# EAGLE design V1.01 (EAGLE 7.7.0)

## Sheet 1 of 4
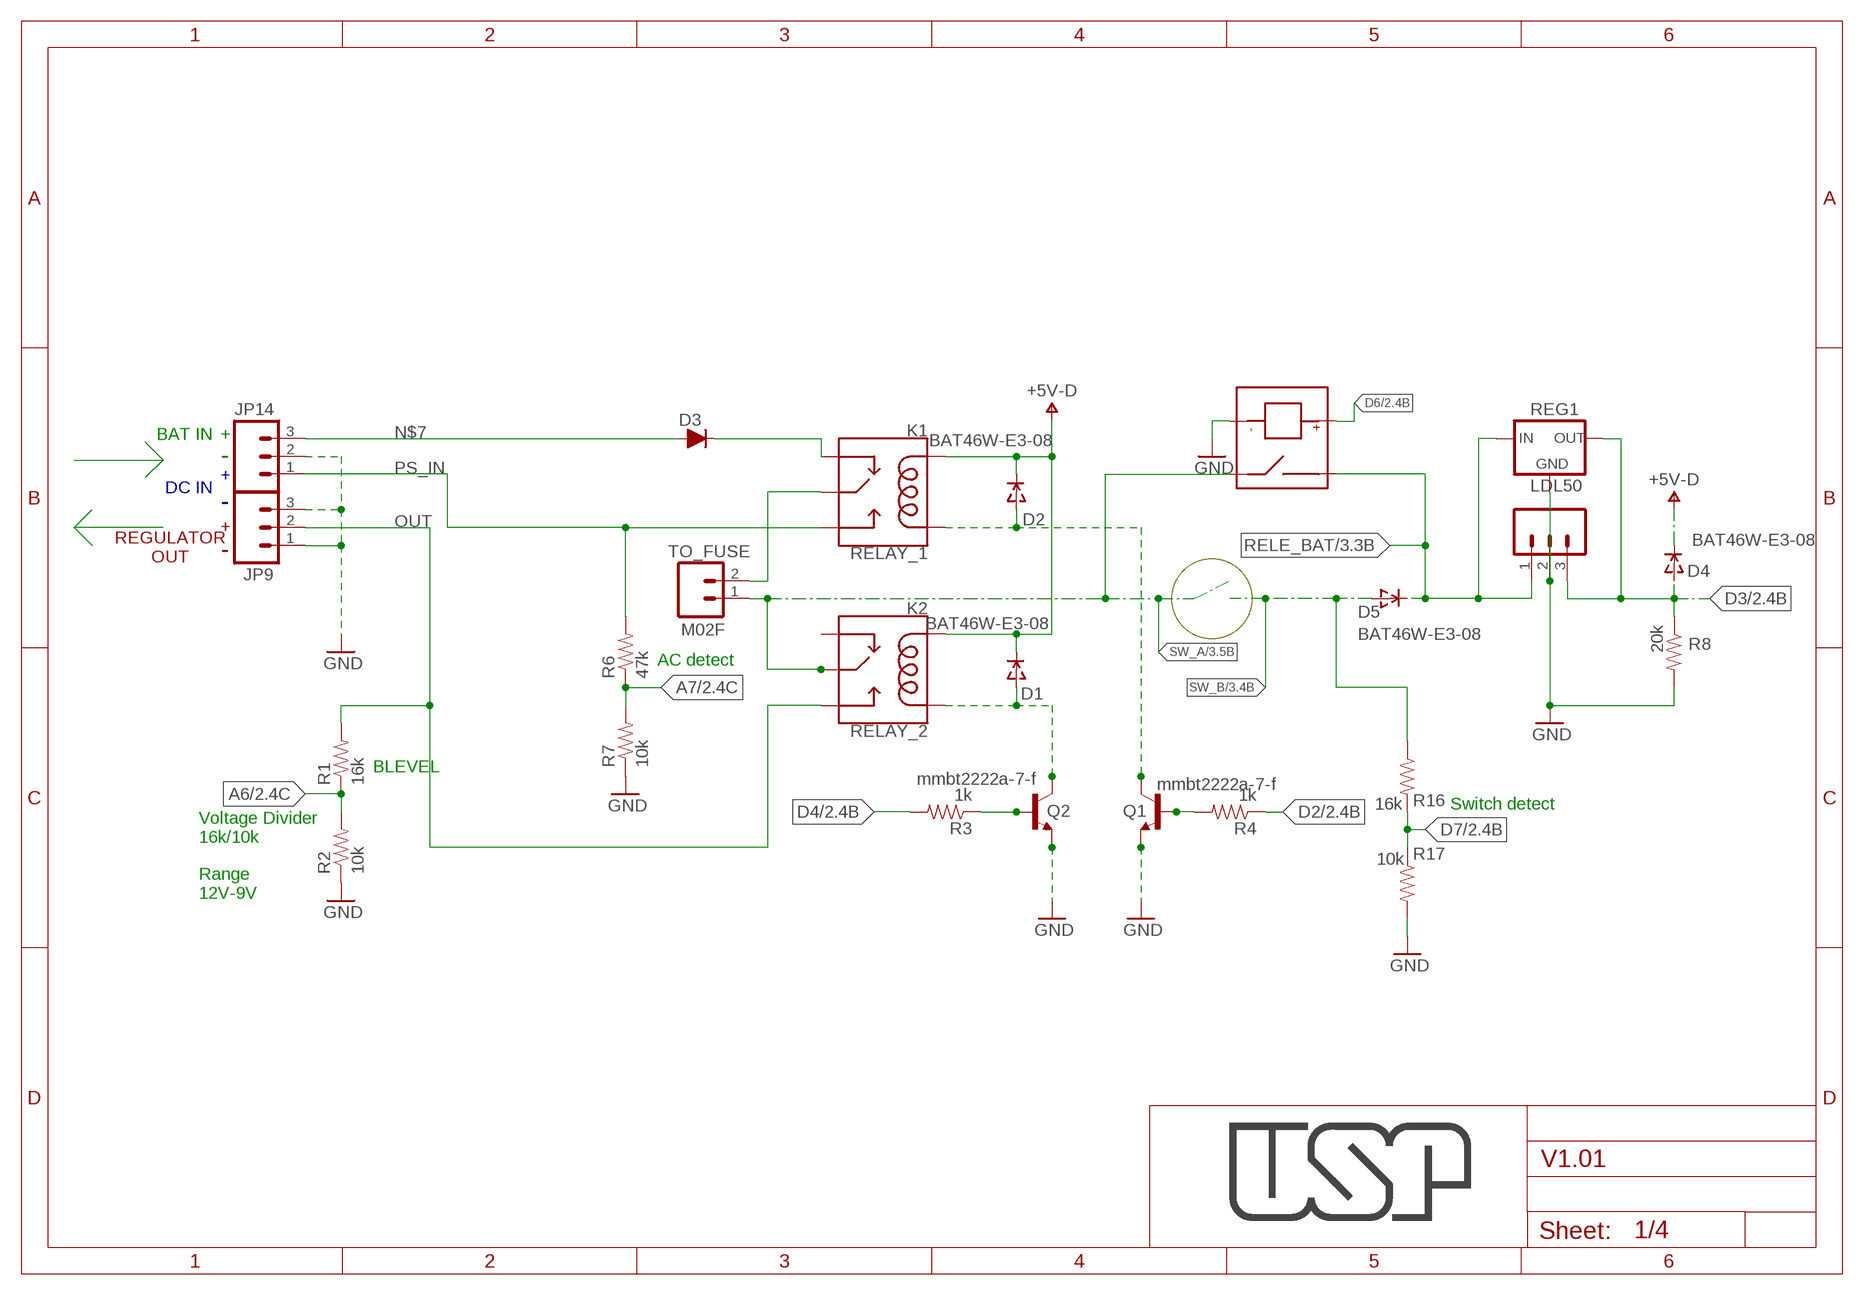
[diagram p0: schematic, sheet 1]

### Parts
7805  M03LOCK  [1X03_LOCK]
D1  BAT46W-E3-08  DIODE_1SOD-123  [SOD-123]
D2  BAT46W-E3-08  DIODE_1SOD-123  [SOD-123]
D3  DIODEFR  [DIODE1.5A]
D4  BAT46W-E3-08  DIODE_1SOD-123  [SOD-123]
D5  BAT46W-E3-08  DIODE_1SOD-123  [SOD-123]
JP9  M03  [AK500]
JP14  M03  [AK500]
K1  RELAY_1  RELAY-PACKA  [RELAY_G5LE]
K2  RELAY_2  RELAY-PACKA  [RELAY_G5LE]
Q1  mmbt2222a-7-f  TRANSISTOR_NPNMPSA42  [SOT23-3]
Q2  mmbt2222a-7-f  TRANSISTOR_NPNMPSA42  [SOT23-3]
Q3  TRANSISTOR-NPN-BC337  [BC337]
Q4  TRANSISTOR-NPN-BC337  [BC337]
R1  16k  RESISTORVISHAY  [0402]
R2  10k  RESISTORVISHAY  [0402]
R3  1k  RESISTORVISHAY  [0402]
R4  1k  RESISTORVISHAY  [0402]
R6  47k  RESISTORVISHAY  [0402]
R7  10k  RESISTORVISHAY  [0402]
R8  20k  RESISTORVISHAY  [0402]
R16  16k  RESISTORVISHAY  [0402]
R17  10k  RESISTORVISHAY  [0402]
REG1  LDL50  REGULATOR_1117AMS117  [SOT223]
RL1  RELAY_HE3621A0500  [HE3621A]
TO_FUSE  M02F  [AK500M2]

### Nets
+5V-D: D1.C D2.C D4.C K1.2(COIL1) K2.2(COIL1) ; also sheet 2,3,4
A6: R1.P$1 R2.P$2 ; also sheet 2
A7: R6.P$1 R7.P$2 ; also sheet 2
D2: R4.P$1 ; also sheet 2
D3: 7805.3 D4.A R8.P$1 REG1.2(OUT) REG1.4(OUT) ; also sheet 2
D4: R3.P$2 ; also sheet 2
D6: RL1.P2 ; also sheet 2,3
D7: R16.P$2 R17.P$1 ; also sheet 2,3
GND: 7805.2 JP9.1 JP9.3 JP14.2 Q1.2(E) Q2.2(E) Q3.1(E) Q4.1(E) R2.P$1 R7.P$1 R8.P$2 R17.P$2 REG1.1(GND) RL1.P3 ; also sheet 2,3,4
N$1: K1.1(MAIN) TO_FUSE.2
N$5: D2.A K1.5(COIL2) Q1.3(C) Q4.3(C)
N$6: D1.A K2.5(COIL2) Q2.3(C) Q3.3(C)
N$7: D3.A JP14.3
N$23: Q1.1(B) Q4.2(B) R4.P$2
N$26: D3.C K1.4(NC)
OUT: JP9.2 K2.3(NO) R1.P$2
PS_IN: JP14.1 K1.3(NO) R6.P$2
RELE_BAT: 7805.1 D5.C REG1.3(IN) RL1.P1 ; also sheet 3
STARTUP: Q2.1(B) Q3.2(B) R3.P$1
SW_A: K2.1(MAIN) RL1.P4 TO_FUSE.1 ; also sheet 3
SW_B: D5.A R16.P$1 ; also sheet 3
Unconnected: K2.4(NC)

### Notes on the sheet
- BAT IN | +
- -
- +
- DC IN
- -
- +
- REGULATOR
  OUT
- -
- AC detect
- BLEVEL
- Switch detect
- Voltage Divider
  16k/10k 
  
  Range
  12V-9V

## Sheet 2 of 4
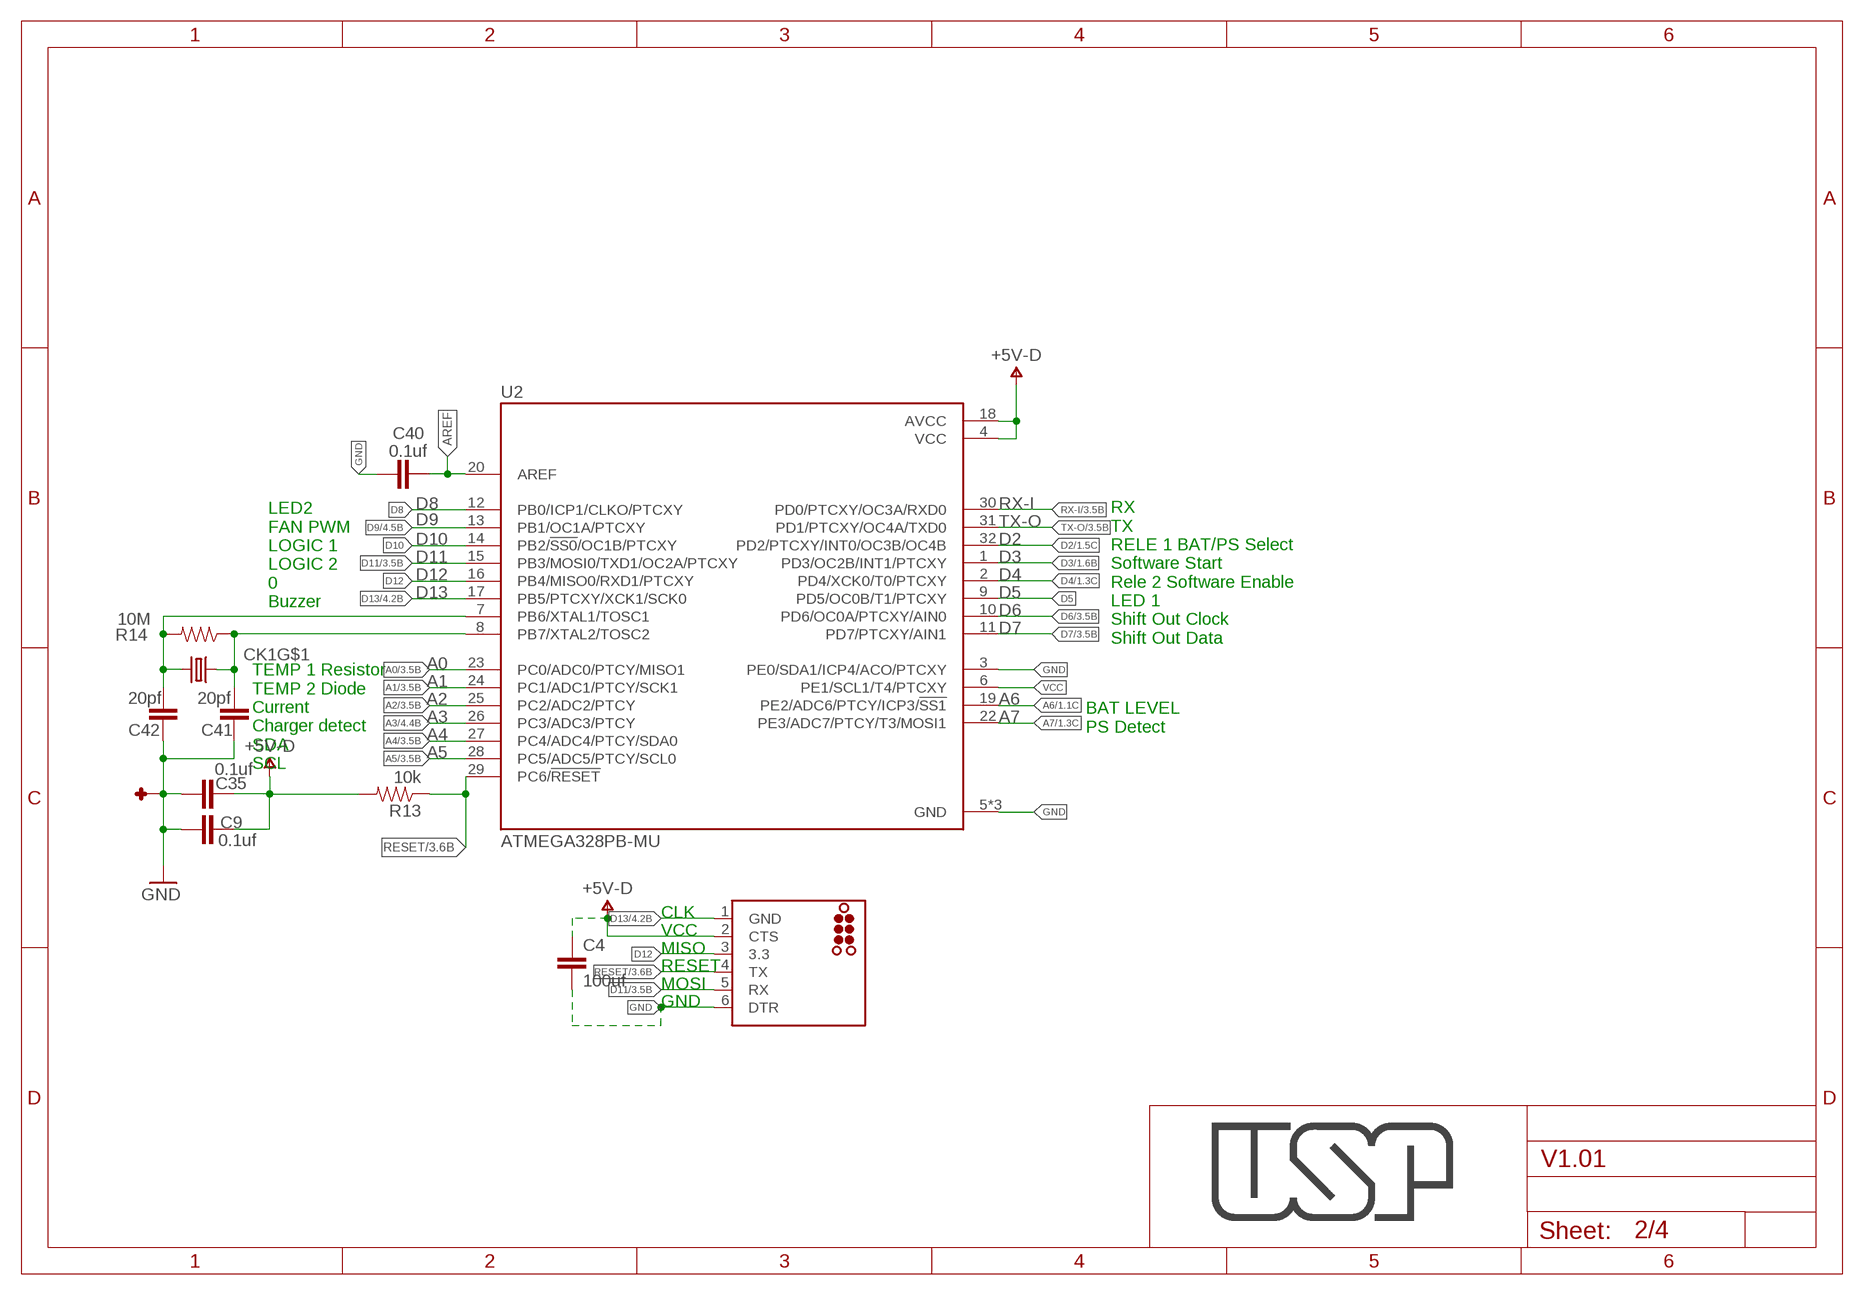
[diagram p1: schematic, sheet 2]

### Parts
C4  100uf  CAPACITOR-KIT-11206  [1206]
C9  0.1uf  CAPACITOR-KIT-1VISHAY  [0402]
C35  0.1uf  CAPACITOR-KIT-1VISHAY  [0402]
C40  0.1uf  CAPACITOR-KIT-1VISHAY  [0402]
C41  20pf  CAPACITOR-KIT-1VISHAY  [0402]
C42  20pf  CAPACITOR-KIT-1VISHAY  [0402]
CK1  FA-238 16.0000MB-C3  CRYSTAL-4PAD  [4-SMD@1]
J10  DNP  FTDI-POGO-MCP-NL  [TC2030-MCP-NL]
R13  10k  RESISTORVISHAY  [0402]
R14  10M  RESISTORVISHAY  [0402]
U2  ATMEGA328PB-MU  [QFN50P500X500X90-33N]

### Nets
+5V-D: C4.1 C9.P$2 C35.P$2 J10.2(CTS) R13.P$2 U2.4(VCC) U2.18(AVCC) ; also sheet 1,3,4
A0: U2.23(PC0/ADC0/PTCY/MISO1) ; also sheet 3
A1: U2.24(PC1/ADC1/PTCY/SCK1) ; also sheet 3
A2: U2.25(PC2/ADC2/PTCY) ; also sheet 3
A3: U2.26(PC3/ADC3/PTCY) ; also sheet 4
A4: U2.27(PC4/ADC4/PTCY/SDA0) ; also sheet 3,4
A5: U2.28(PC5/ADC5/PTCY/SCL0) ; also sheet 3,4
A6: U2.19(PE2/ADC6/PTCY/ICP3/!SS1!) ; also sheet 1
A7: U2.22(PE3/ADC7/PTCY/T3/MOSI1) ; also sheet 1
AREF: C40.P$1 U2.20(AREF)
D2: U2.32(PD2/PTCXY/INT0/OC3B/OC4B) ; also sheet 1
D3: U2.1(PD3/OC2B/INT1/PTCXY) ; also sheet 1
D4: U2.2(PD4/XCK0/T0/PTCXY) ; also sheet 1
D5: U2.9(PD5/OC0B/T1/PTCXY)
D6: U2.10(PD6/OC0A/PTCXY/AIN0) ; also sheet 1,3
D7: U2.11(PD7/PTCXY/AIN1) ; also sheet 1,3
D8: U2.12(PB0/ICP1/CLKO/PTCXY)
D9: U2.13(PB1/OC1A/PTCXY) ; also sheet 4
D10: U2.14(PB2/!SS0!/OC1B/PTCXY)
D11: J10.5(RX) U2.15(PB3/MOSI0/TXD1/OC2A/PTCXY) ; also sheet 3
D12: J10.3(3.3) U2.16(PB4/MISO0/RXD1/PTCXY)
D13: J10.1(GND) U2.17(PB5/PTCXY/XCK1/SCK0) ; also sheet 4
GND: C4.2 C9.P$1 C35.P$1 C40.P$2 C41.P$2 C42.P$2 CK1.GND1 CK1.GND2 J10.6(DTR) U2.3(PE0/SDA1/ICP4/ACO/PTCXY) U2.5(GND) U2.21(GND) U2.33(GND) ; also sheet 1,3,4
N$67: C41.P$1 CK1.P1 R14.P$1 U2.8(PB7/XTAL2/TOSC2)
N$68: C42.P$1 CK1.P3 R14.P$2 U2.7(PB6/XTAL1/TOSC1)
RESET: J10.4(TX) R13.P$1 U2.29(PC6/!RESET!) ; also sheet 3
RX-I: U2.30(PD0/PTCXY/OC3A/RXD0) ; also sheet 3
TX-O: U2.31(PD1/PTCXY/OC4A/TXD0) ; also sheet 3
VCC: U2.6(PE1/SCL1/T4/PTCXY)

### Notes on the sheet
- RX
  TX
  RELE 1 BAT/PS Select
  Software Start
  Rele 2 Software Enable
  LED 1
  Shift Out Clock
  Shift Out Data
- D8
- D9
- D11
- LED2
  FAN PWM
  LOGIC 1
  LOGIC 2
  0
  Buzzer
- BAT LEVEL
  PS Detect
- A2
- TEMP 1 Resistor
  TEMP 2 Diode
  Current
  Charger detect
  SDA
  SCL
- CLK
  VCC
  MISO
  RESET
  MOSI
  GND

## Sheet 3 of 4
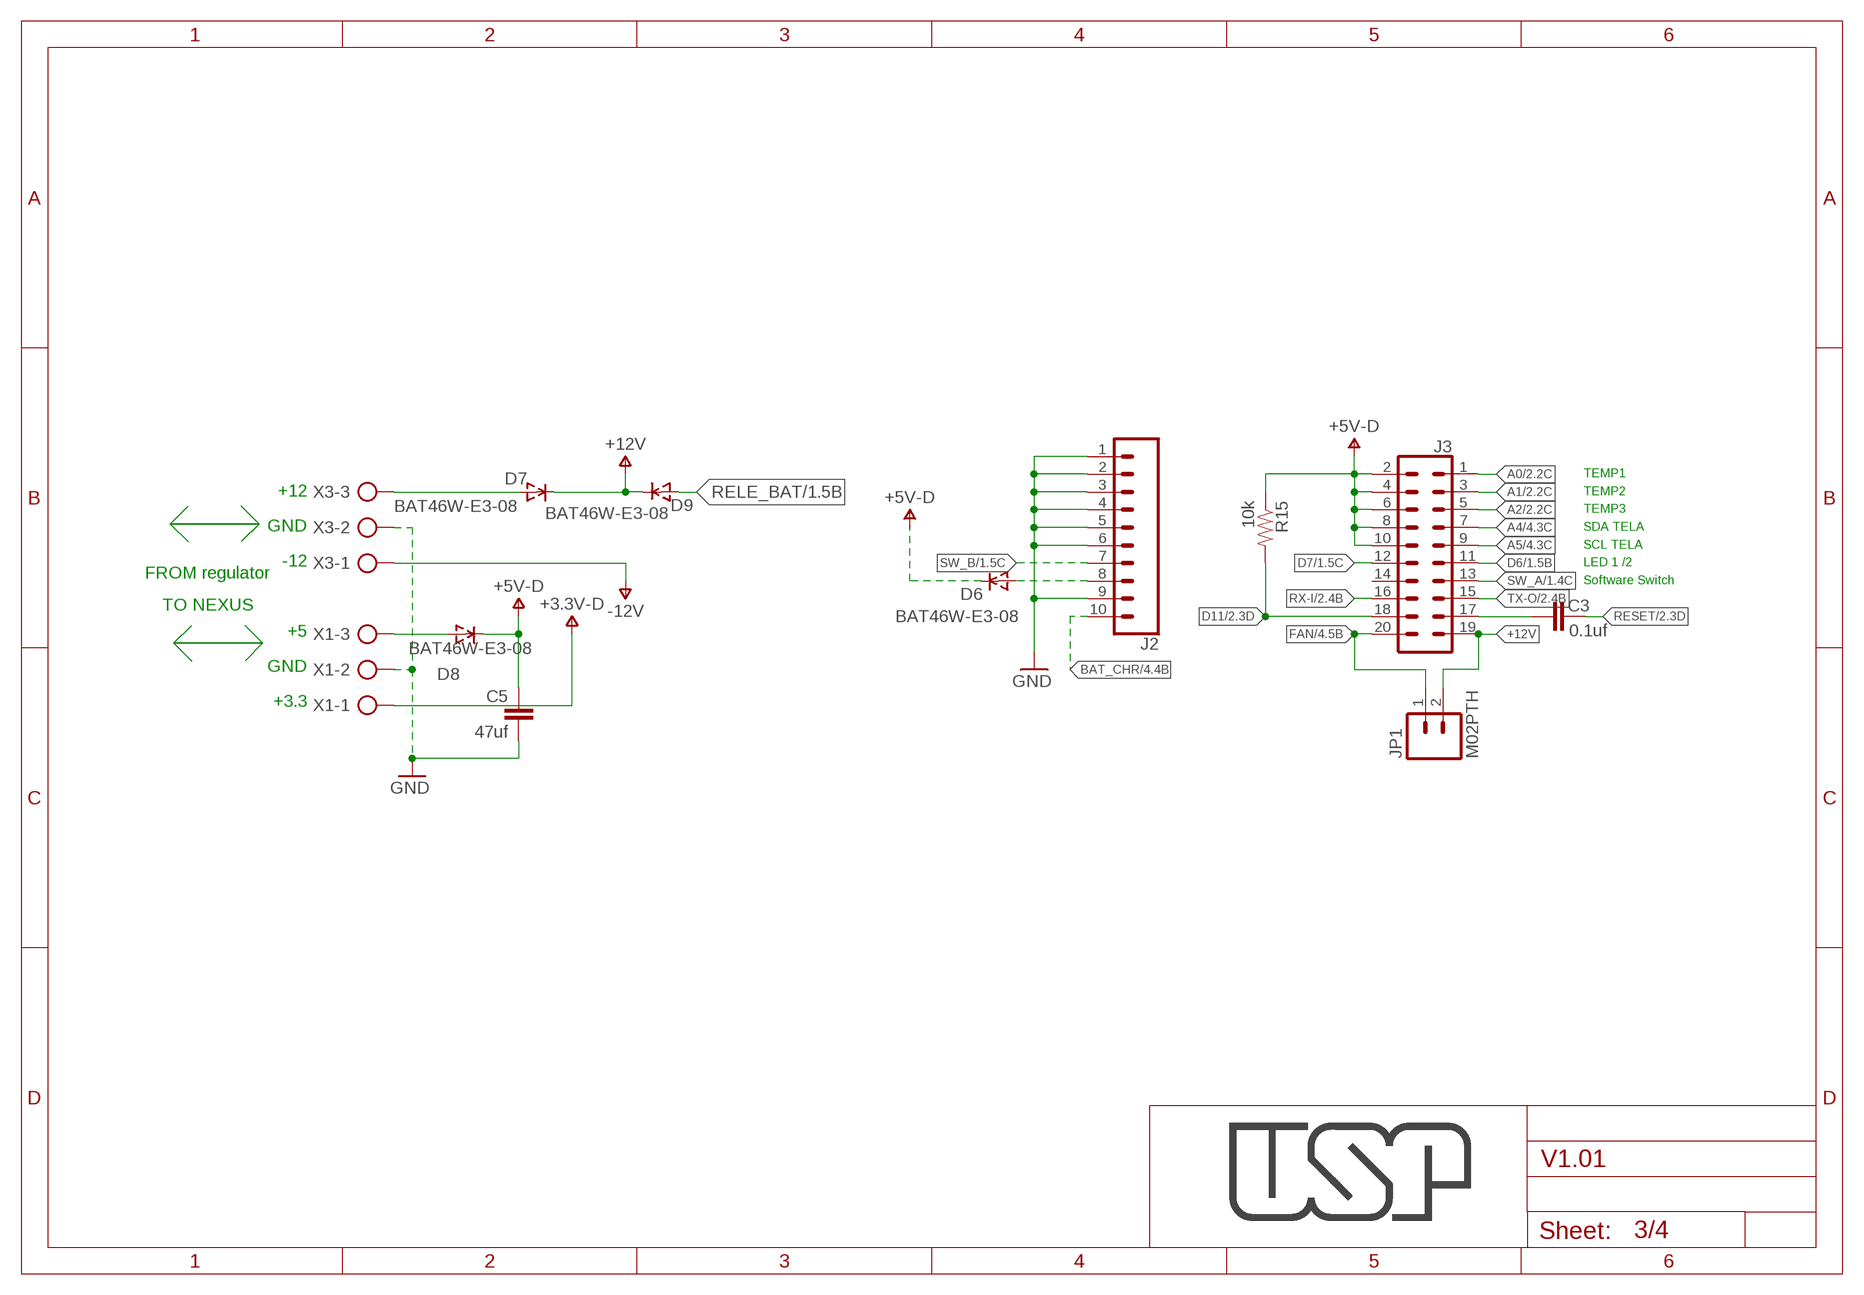
[diagram p2: schematic, sheet 3]

### Parts
C3  0.1uf  CAPACITOR-KIT-1VISHAY  [0402]
C5  47uf  CAPACITOR-KIT-11206  [1206]
D6  BAT46W-E3-08  DIODE_1SOD-123  [SOD-123]
D7  BAT46W-E3-08  DIODE_1SOD-123  [SOD-123]
D8  BAT46W-E3-08  DIODE_1SOD-123  [SOD-123]
D9  BAT46W-E3-08  DIODE_1SOD-123  [SOD-123]
J2  CONN_10"  [1X10]
J3  CONN_10X2  [2X10]
JP1  M02PTH  [1X02]
R15  10k  RESISTORVISHAY  [0402]
X1  AK500/3-H  [AK500/3-H]
X3  AK500/3-H  [AK500/3-H]

### Nets
+3.3V-D: X1.1
+5V-D: C5.1 D6.C D8.C J3.2 J3.4 J3.6 J3.8 J3.10 R15.P$1 ; also sheet 1,2,4
+12V: D7.C D9.C J3.19 JP1.2
-12V: X3.1
A0: J3.1 ; also sheet 2
A1: J3.3 ; also sheet 2
A2: J3.5 ; also sheet 2
A4: J3.7 ; also sheet 2,4
A5: J3.9 ; also sheet 2,4
BAT_CHR: J2.10 ; also sheet 4
D6: J3.11 ; also sheet 1,2
D7: J3.12 ; also sheet 1,2
D11: J3.18 R15.P$2 ; also sheet 2
FAN: J3.20 JP1.1 ; also sheet 4
GND: C5.2 J2.1 J2.2 J2.3 J2.4 J2.5 J2.6 J2.9 X1.2 X3.2 ; also sheet 1,2,4
N$2: D8.A X1.3
N$3: D6.A J2.8
N$8: D7.A X3.3
RELE_BAT: D9.A ; also sheet 1
RESET: C3.P$2 ; also sheet 2
RESETT: C3.P$1 J3.17
RX-I: J3.16 ; also sheet 2
SW_A: J3.13 ; also sheet 1
SW_B: J2.7 ; also sheet 1
TX-O: J3.15 ; also sheet 2
Unconnected: J3.14

### Notes on the sheet
- +12
  
  GND
  
  -12
- FROM regulator
- TEMP1
  TEMP2
  TEMP3
  SDA TELA
  SCL TELA
  LED 1 /2
  Software Switch
- TO NEXUS
- +5
  
  GND
  
  +3.3

## Sheet 4 of 4
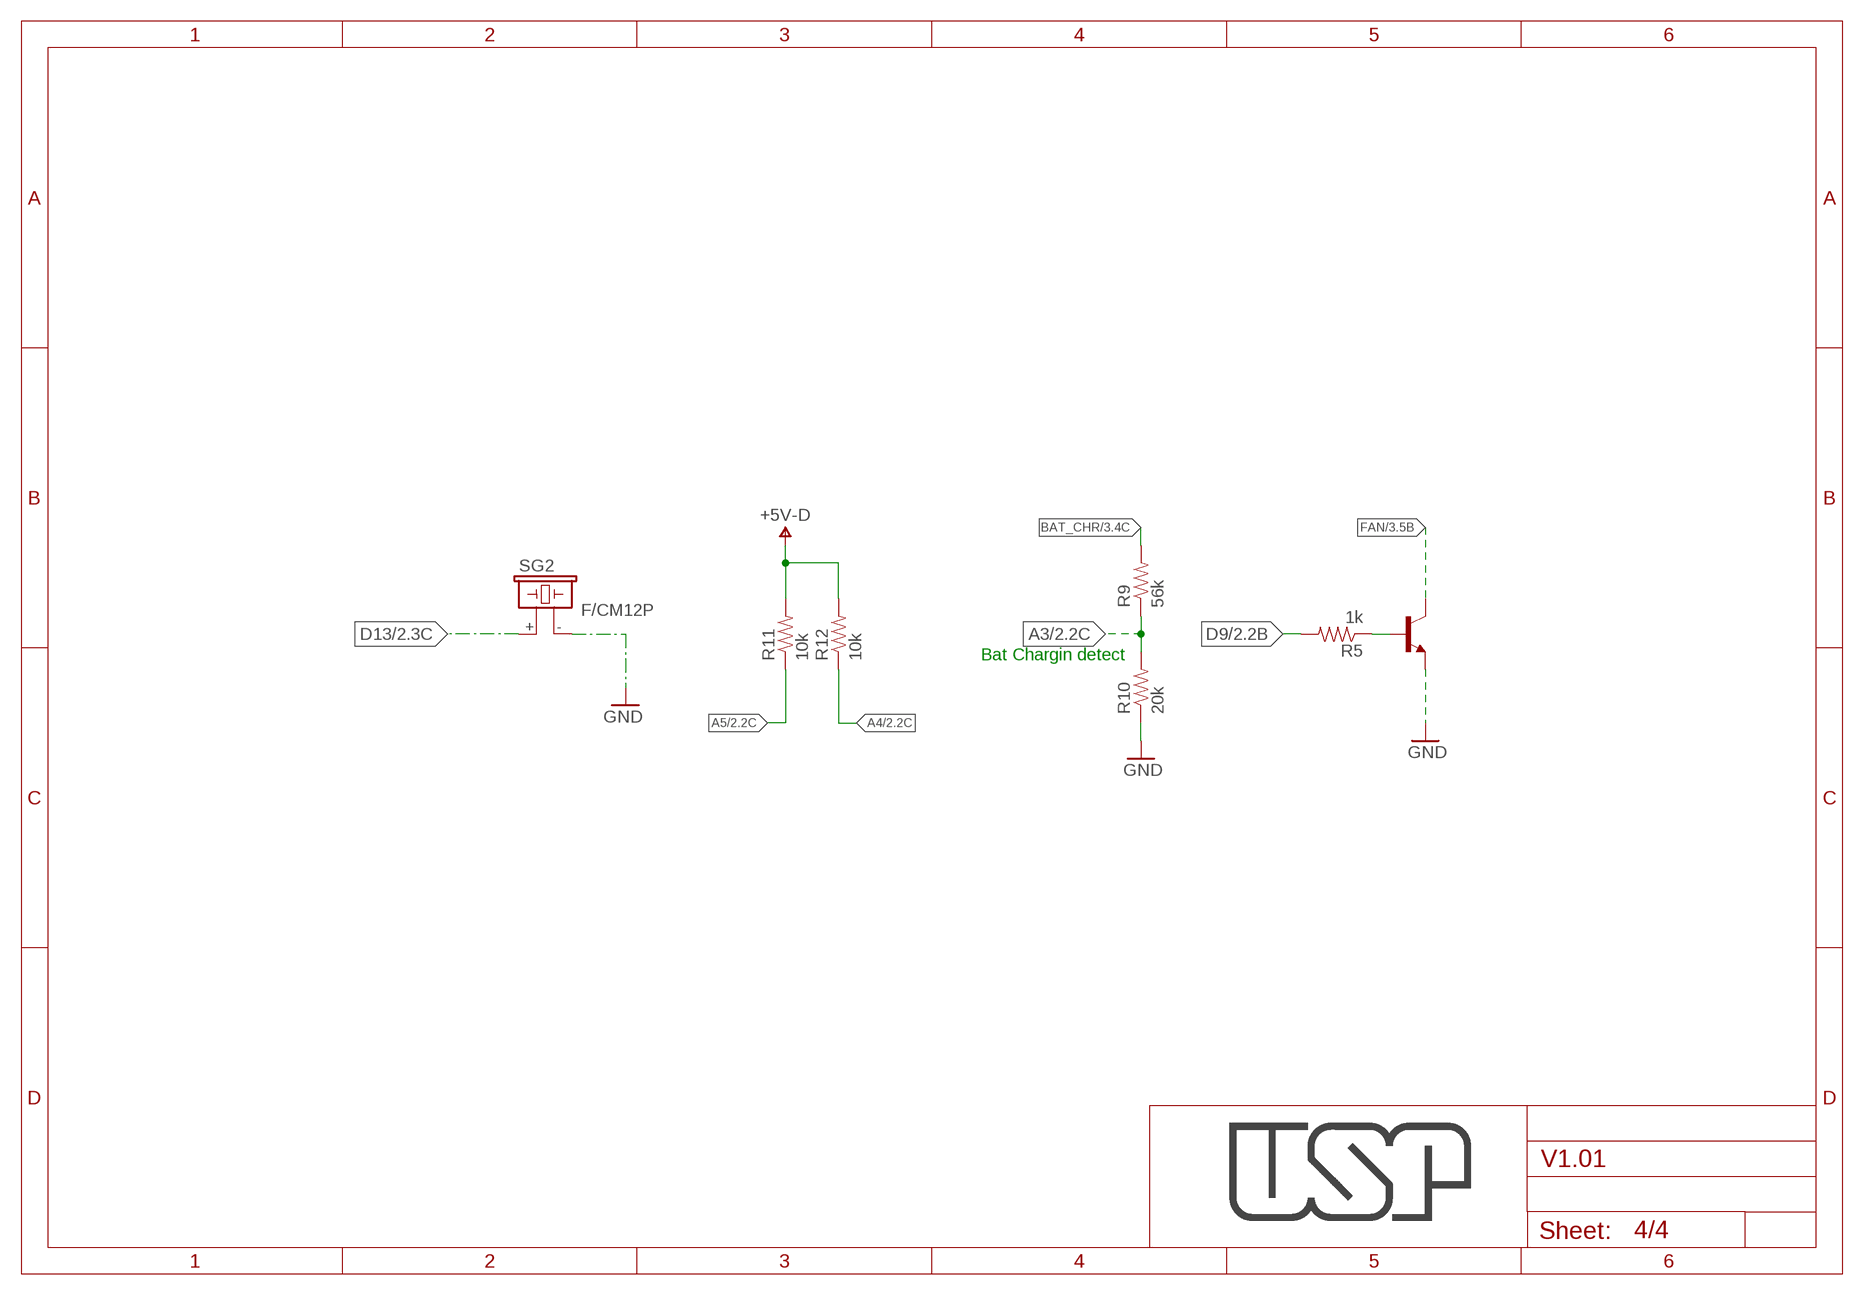
[diagram p3: schematic, sheet 4]

### Parts
Q5  TRANSISTOR-NPN-BC337  [BC337]
R5  1k  RESISTORVISHAY  [0402]
R9  56k  RESISTORVISHAY  [0402]
R10  20k  RESISTORVISHAY  [0402]
R11  10k  RESISTORVISHAY  [0402]
R12  10k  RESISTORVISHAY  [0402]
SG2  F/CM12P  [F/CM12P]

### Nets
+5V-D: R11.P$2 R12.P$2 ; also sheet 1,2,3
A3: R9.P$1 R10.P$2 ; also sheet 2
A4: R12.P$1 ; also sheet 2,3
A5: R11.P$1 ; also sheet 2,3
BAT_CHR: R9.P$2 ; also sheet 3
D9: R5.P$2 ; also sheet 2
D13: SG2.+ ; also sheet 2
FAN: Q5.3(C) ; also sheet 3
GND: Q5.1(E) R10.P$1 SG2.- ; also sheet 1,2,3
N$21: Q5.2(B) R5.P$1

### Notes on the sheet
- Bat Chargin detect

## Library data of the parts
7805 JP9 JP14 = 1MaxBYB-Parts:M03: Header 3 Standard 3-pin 0.1" header. Use with straight break away headers (SKU : PRT-00116), right angle break away headers (PRT-00553), swiss pins (PRT-00743), machine pins (PRT-00117), and female headers (PRT-00115). Molex polarized connector foot print use with SKU : PRT-08232 with associated crimp pins and housings.
C3-C5 C9 C35 C40-C42 = 1MaxBYB-Parts:CAPACITOR-KIT-1: Capacitor Standard 0603 ceramic capacitor, and 0.1" leaded capacitor.
CK1 = 1MaxBYB-Parts:CRYSTAL-4PAD
D1 D2 D4-D9 = dp_devices:DIODE_1: Zener Diode SOD-323
D3 = 1MaxBYB-Parts:DIODE: DIODE filled
J2 = SparkFun-Connectors:CONN_10: Multi connection point. Often used as Generic Header-pin footprint for 0.1 inch spaced/style header connections On any of the 0.1 inch spaced packages, you can populate with these: Break Away Headers - Straight <https://www.sparkfun.com/products/116> (PRT-00116) Break Away Male Headers - Right Angle <https://www.sparkfun.com/products/553> (PRT-00553) Female Headers <https://www.sparkfun.com/products/115> (PRT-00115) Break Away Headers - Machine Pin <https://www.sparkfun.com/products/117> (PRT-00117) Break Away Female Headers - Swiss Machine Pin <https://www.sparkfun.com/products/743> (PRT-00743) Arduino Stackable Header - 10 Pin <https://www.sparkfun.com/products/11376> (PRT-11376) For SCREWTERMINALS and SPRING TERMINALS visit here: Screw Terimnals on SparkFun.com <https://www.sparkfun.com/search/results?term=Screw+Terminals> (5mm/3.5mm/2.54mm spacing) This device is also useful as a general connection point to wire up your design to another part of your project. Our various solder wires solder well into these plated through hole pads. Hook-Up Wire - Assortment (Stranded, 22 AWG) <https://www.sparkfun.com/products/11375> (PRT-11375) Hook-Up Wire - Assortment (Solid Core, 22 AWG) <https://www.sparkfun.com/products/11367> (PRT-11367) View the entire wire category on our website here <https://www.sparkfun.com/categories/141> Special notes: Molex polarized connector foot print use with SKU : PRT-08231 with associated crimp pins and housings. 1MM SMD Version SKU: PRT-10208 NOTES ON THE VARIANTS LOCK and LOCK_LONGPADS... This footprint was designed to help hold the alignment of a through-hole component (i.e. 6-pin header) while soldering it into place. You may notice that each hole has been shifted either up or down by 0.005 of an inch from it's more standard position (which is a perfectly straight line). This slight alteration caused the pins (the squares in the middle) to touch the edges of the holes. Because they are alternating, it causes a "brace" to hold the component in place. 0.005 has proven to be the perfect amount of "off-center" position when using our standard breakaway headers. Although looks a little odd when you look at the bare footprint, once you have a header in there, the alteration is very hard to notice. Also,if you push a header all the way into place, it is covered up entirely on the bottom side.; PROD_ID: CONN-11563
J3 = SparkFun-Connectors:CONN_10X2: Multi connection point. Often used as Generic Header-pin footprint for 0.1 inch spaced/style header connections On any of the 0.1 inch spaced packages, you can populate with these: Break Away Headers - Straight <https://www.sparkfun.com/products/116> (PRT-00116) Break Away Male Headers - Right Angle <https://www.sparkfun.com/products/553> (PRT-00553) Female Headers <https://www.sparkfun.com/products/115> (PRT-00115) Break Away Headers - Machine Pin <https://www.sparkfun.com/products/117> (PRT-00117) Break Away Female Headers - Swiss Machine Pin <https://www.sparkfun.com/products/743> (PRT-00743) Special note about the "SPECIAL" package: This was SPECIALLY designed to be used with our Graphic LCD Backpack. Be sure you want to use this! It is not only staggered on each line of header holes, but IT IS ALSO offset of the center point of the top and bottom lines by 5 mil. This causes the headers to lock into place on the "standard" footprint on the LCD screen. The extra squares on the tdocu layer are there simply to reference other pins (if you were to actually populate a longer header than ten long - this is what we do with the backpacks).
J10 = MaxBYB:FTDI-POGO: TAG-CONNECT ICSP Connector Manufacturer: Tag-Connect <http://www.tag-connect.com> Cable for easy In-Circuit Serial Programming. Designed for Microchip ICD2, suitable for many others. Two variants - one "with legs" (for hands-free fit on PCB) and another "without legs" for quick programming. PAD Description 1 MCLR/Vpp 2 Vdd 3 GND 4 PGD (ISPDAT) 5 PGC (ISPCLK) 6 nc (used for LVP) ©2009 ROFA.cz - modified and updated by Robert Darlington ‹rdarlington@gmail.com›
JP1 TO_FUSE = 1MaxBYB-Parts:M02: Standard 2-pin 0.1" header. Use with - straight break away headers ( PRT-00116) - right angle break away headers (PRT-00553) - swiss pins (PRT-00743) - machine pins (PRT-00117) - female headers (PRT-00115) Molex polarized connector foot print use with: PRT-08233 with associated crimp pins and housings. 2.54_SCREWTERM for use with PRT-10571. 3.5mm Screw Terminal footprints for PRT-08084 5mm Screw Terminal footprints for use with PRT-08432
K1 K2 = 1MaxBYB-Parts:RELAY-PACK: SPDT Electromechanical Relay Single-pole, double-throw sealed relays. When current is applied to the coil, it throws a simple changeover switch, terminating the connection from the NC contact to ground and closing the NO contact. Use them to switch high voltage/high current devices. SparkFun Products JQX-15F: Relay SPDT Sealed - 20A <https://www.sparkfun.com/products/10924> (COM-10924) JZC-11F: Relay SPDT Sealed <https://www.sparkfun.com/products/100> (COM-00100); PROD_ID: COMP-14214
Q1 Q2 = MaxBYB:TRANSISTOR_NPN: Generic NPN BJT MMBT2222A - TRANS-08049 (SOT-23, 1A 40V) MPSA42 - TRANS-09116 (SOT-23, 500mA 300V) MMBT5088LT1G - TRANS-11160 (SOT-23, 50 mA 30V) BC547 - COM-08928 <http://www.sparkfun.com/products/8928> (TO-92 45V 100mA) (1.Collector 2.Base 3.Emitter) 2N3904 - COM-00521 <http://www.sparkfun.com/products/521> (TO-92 40V 200mA) (1.Emitter 2.Base 3.Collector) P2N2222A - COM-12852 <http://www.sparkfun.com/products/12852> (TO-92 40V 600mA) (1.Collector 2.Base 3.Emitter); PROD_ID: TRANS-09116; VALUE: MPSA42
Q3-Q5 = 1MaxBYB-Parts:TRANSISTOR-NPN-BC337
R1-R17 = 1MaxBYB-Parts:RESISTOR: Resistor Basic schematic elements and footprints for 0603, 1206, and PTH 1/10th watt (small) resistors.
REG1 = 1MaxBYB-Parts:REGULATOR_1117
RL1 = 1MaxBYB-Parts:RELAY_HE3621A0500
SG2 = buzzer:F/CM12P: BUZZER Source: Buerklin; OC_FARNELL: unknown; OC_NEWARK: unknown
U2 = ATMEGA328PB-MU:ATMEGA328PB-MU: AVR 32KBytes Flash, 1KBytes EEPROM, 2KBytes RAM, w - 20MHZ, QFN/MFL, IND TEMP, GREEN 5 V/ DFN/QFN (M); AVAILABILITY: Unavailable; DESCRIPTION: AVR 32KBytes Flash, 1KBytes EEPROM, 2KBytes RAM, w - 20MHZ, QFN/MFL, IND TEMP, GREEN 5 V/ DFN/QFN _M_; MF: Microchip; MP: ATMEGA328PB-MU; PACKAGE: VFQFN-32 Microchip; PRICE: None
X1 X3 = con-ptr500:AK500/3-H: CONNECTOR Aug. 2004 / PTR Meßtechnik: Die Bezeichnung der Serie AK505 wurde geändert. Es handelt sich hierbei um AK500 in horizontaler Ausführung.; OC_FARNELL: unknown; OC_NEWARK: unknown

## Board
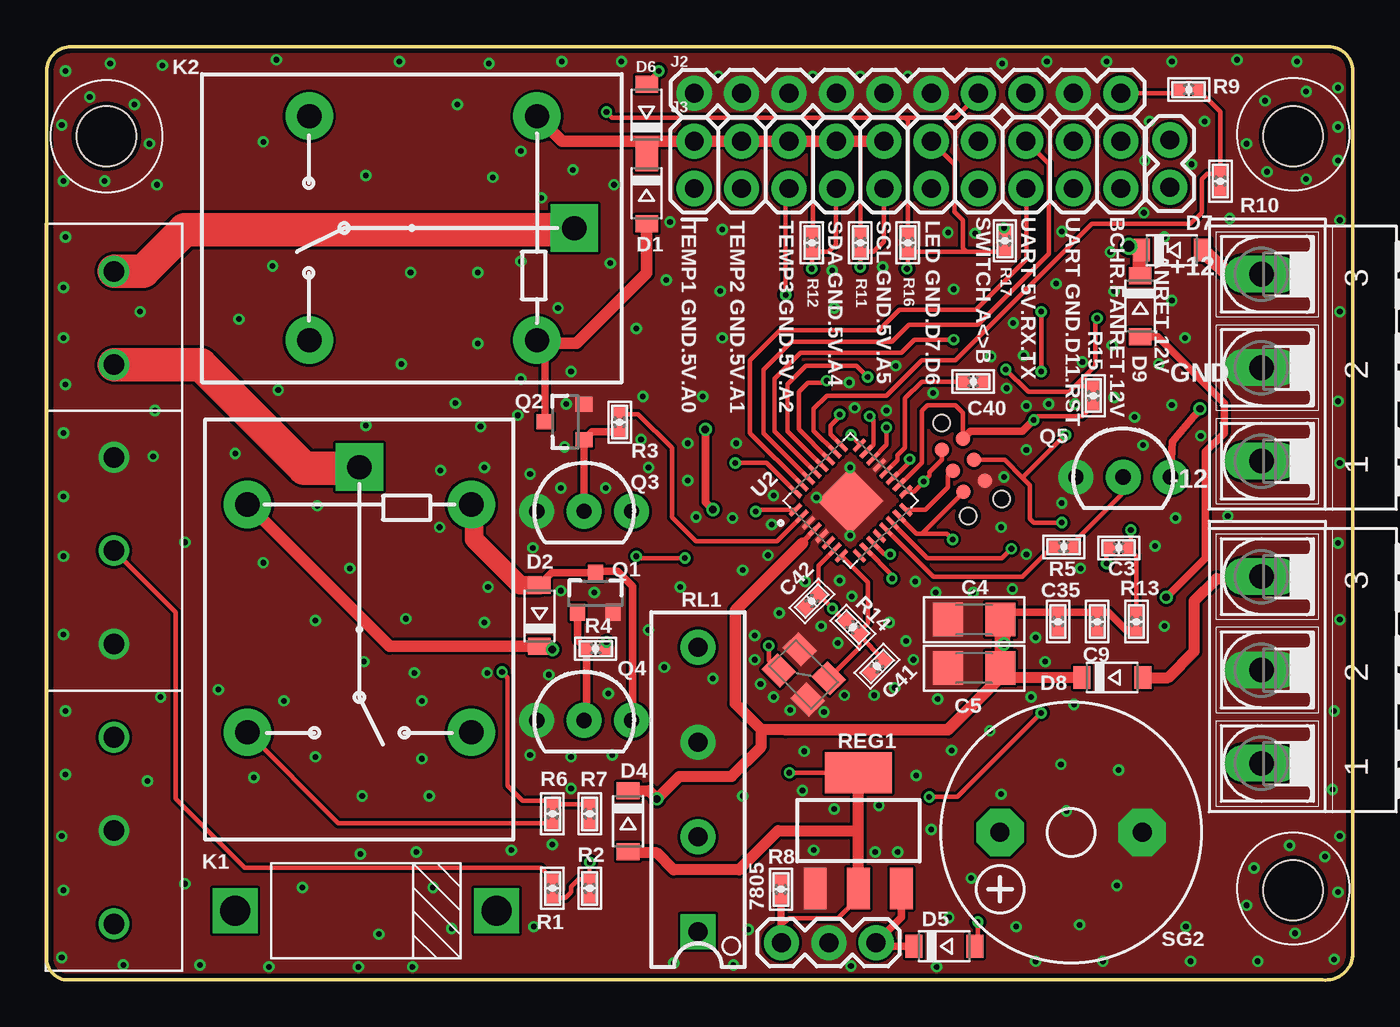
[diagram p4: board, top side]
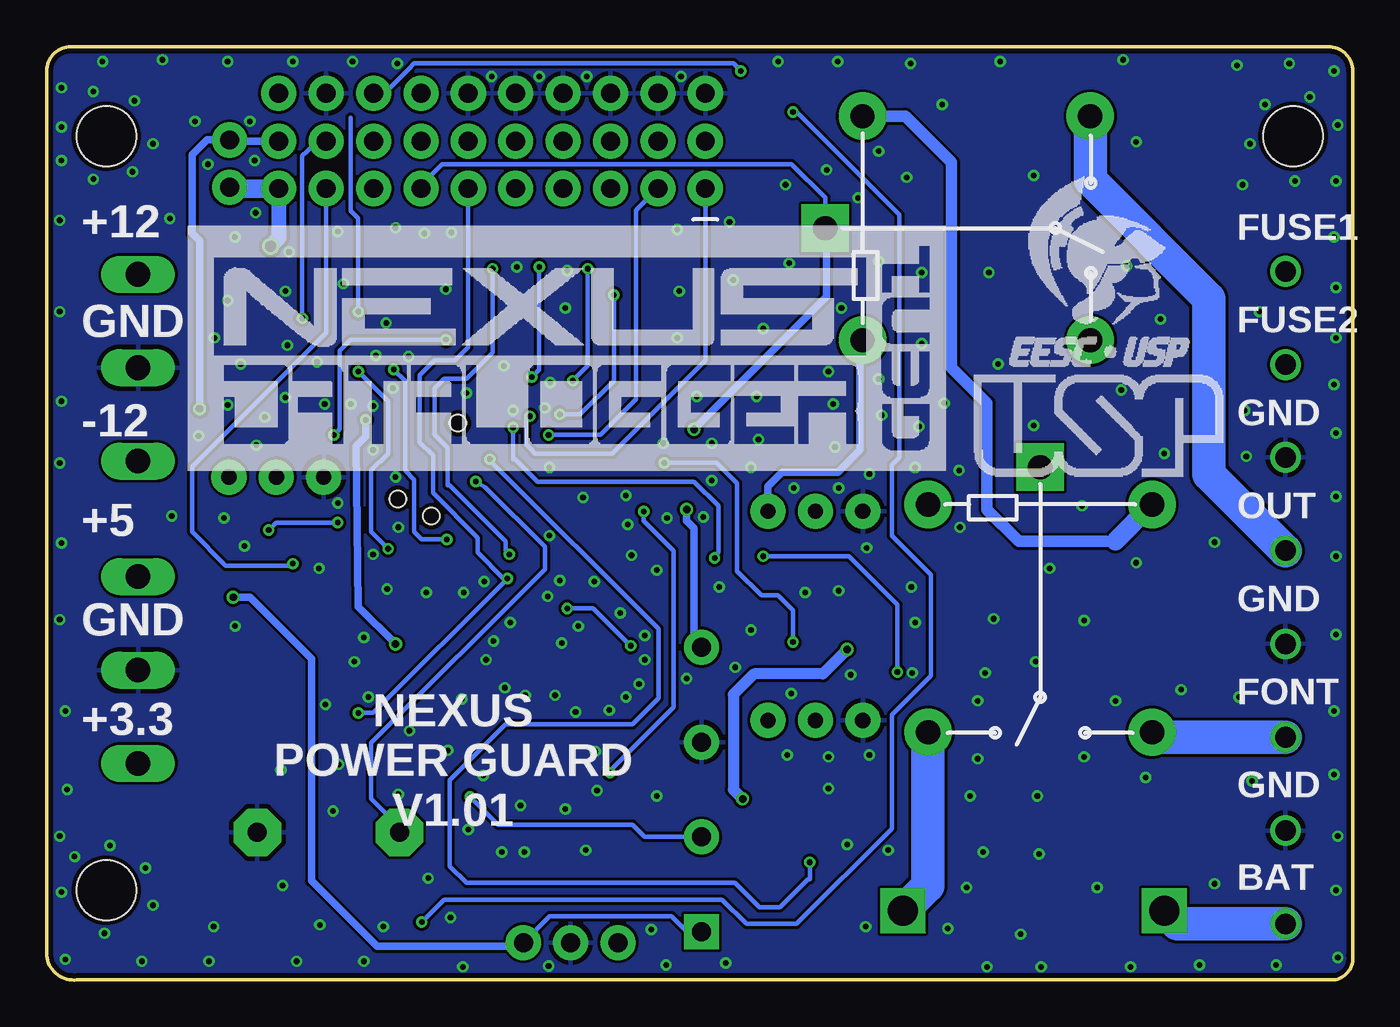
[diagram p5: board, bottom side, seen from below]

Size 70.01 x 50.01 mm. Coordinates in mm from the lower left corner, seen from the top.
Outline: 1.01,0.01 68.41,0.01 arc90 70.01,1.31 70.01,48.71 arc90 68.71,50.01 1.31,50.01 arc90 0.01,48.71 0.01,1.31 arc90 1.01,0.01
Copper layers (1+16): Top 0.035mm / dielectric 1.5mm / Bottom 0.035mm
Design rules "Max_ProV4": minimum track width 0.2mm, minimum drill 0.3mm, track to track 6mil, track to pad 6mil, pad to pad 6mil, via to via 6mil, smd to smd 0mil, copper to edge 10mil, drill to drill 10mil, minimum pad ring 10mil, minimum via ring 6mil, stop-mask expansion 2mil, vias tented up to drill 100mil, thermal gap 10mil
Holes 3.2 mm at 3.21,45.21 66.81,45.21 66.81,4.81

### Footprints (pad centres in the part's own frame; a part is rotated, then mirrored left to right if it is on the bottom)
1X03_LOCK = drill 1.016 pad 1.88: 1 0,0; 2 2.54,0; 3 5.08,0
0402 = smd 0.6 x 0.7: P$1 -0.5,0; P$2 0.5,0
1206 = smd 1.6 x 1.8: 1 -1.4,0; 2 1.4,0
4-SMD@1 = smd 1.4 x 1.2: GND1 1.1,-0.8; GND2 -1.1,0.8; P1 -1.1,-0.8; P3 1.1,0.8
SOD-123 = smd 0.91 x 1.22: A 1.635,0; C -1.635,0
DIODE1.5A = drill 1.6 square: A 7,0; C -7,0
1X10 = drill 1.016 pad 1.88: 1 0,0; 2 2.54,0; 3 5.08,0; 4 7.62,0; 5 10.16,0; 6 12.7,0; 7 15.24,0; 8 17.78,0; 9 20.32,0; 10 22.86,0
2X10 = drill 1.016 pad 1.88: 1 0,0; 2 0,2.54; 3 2.54,0; 4 2.54,2.54; 5 5.08,0; 6 5.08,2.54; 7 7.62,0; 8 7.62,2.54; 9 10.16,0; 10 10.16,2.54; 11 12.7,0; 12 12.7,2.54; 13 15.24,0; 14 15.24,2.54; 15 17.78,0; 16 17.78,2.54; 17 20.32,0; 18 20.32,2.54; 19 22.86,0; 20 22.86,2.54
TC2030-MCP-NL = smd 0.787 x 0.787: 1 1.27,-0.635; 2 1.27,0.635; 3 2.54,-0.635; 4 2.54,0.635; 5 3.81,-0.635; 6 3.81,0.635 | hole 0.889: 0,0; 5.08,-1.016; 5.08,1.016
1X02 = drill 1.016 pad 1.88: 1 0,0; 2 2.54,0
AK500 = drill 1.1: 1 -5,0; 2 0,0; 3 5,0
RELAY_G5LE = drill 1.3 pad 2.54 square: 1 8.52,-0.005 | drill 1.3 pad 2.54: 2 6.52,5.995; 3 -5.68,5.995; 4 -5.68,-6.005; 5 6.52,-6.005
SOT23-3 = smd 0.8 x 0.9: 1 -0.95,-1; 2 0.95,-1; 3 0,1.1
BC337 = drill 0.813 pad 1.88: 1 -2.54,0; 2 0,0; 3 2.54,0
SOT223 = smd 1.219 x 2.235: 1 -2.311,-3.099; 2 0,-3.099; 3 2.311,-3.099 | smd 3.6 x 2.2: 4 0,3.099
HE3621A = drill 1.016 pad 1.88 square: P1 -7.62,0 | drill 1.016 pad 1.88: P2 -2.54,0; P3 2.54,0; P4 7.62,0
F/CM12P = drill 1.016 pad 2.54 octagon: + 3.81,0; - -3.81,0
AK500M2 = drill 1.1: 1 -2.46,0; 2 2.54,0
QFN50P500X500X90-33N = smd 0.86 x 0.26: 1 -2.435,1.75; 2 -2.435,1.25; 3 -2.435,0.75; 4 -2.435,0.25; 5 -2.435,-0.25; 6 -2.435,-0.75; 7 -2.435,-1.25; 8 -2.435,-1.75; 17 2.435,-1.75; 18 2.435,-1.25; 19 2.435,-0.75; 20 2.435,-0.25; 21 2.435,0.25; 22 2.435,0.75; 23 2.435,1.25; 24 2.435,1.75 | smd 0.26 x 0.86: 9 -1.75,-2.435; 10 -1.25,-2.435; 11 -0.75,-2.435; 12 -0.25,-2.435; 13 0.25,-2.435; 14 0.75,-2.435; 15 1.25,-2.435; 16 1.75,-2.435; 25 1.75,2.435; 26 1.25,2.435; 27 0.75,2.435; 28 0.25,2.435; 29 -0.25,2.435; 30 -0.75,2.435; 31 -1.25,2.435; 32 -1.75,2.435 | smd 2.5 x 2.5: 33 0,0
AK500/3-H = drill 1.321 long: 1 -5.004,0; 2 0,0; 3 5.004,0

### Placement (x,y rotation side)
7805  44.46,2.01 180 top
C3  57.46,23.16 0 top
C4  49.71,19.31 180 top
C5  49.71,16.71 180 top
C9  56.31,19.21 90 top
C35  54.21,19.21 90 top
C40  49.66,32.06 0 top
C41  44.51,16.81 225 top
C42  41.01,20.31 225 top
CK1  40.58,16.38 135 top
D1  32.16,42.16 270 top
D2  26.41,19.51 90 top
D3  17.11,3.71 180 top
D4  31.16,8.51 270 top
D5  48.11,1.81 0 top
D6  32.16,46.36 90 top
D7  60.31,39.11 0 top
D8  57.11,16.21 0 top
D9  58.61,36.11 270 top
J2  34.71,47.51 0 top
J3  34.71,42.41 0 top
J10  47.97,29.84 297.2 top
JP1  60.21,45.01 270 top
JP9  3.61,23.01 270 top
JP14  3.61,8.01 270 top
K1  16.76,18.96 90 top
K2  19.76,40.29 0 top
Q1  29.41,20.71 0 top
Q2  27.81,29.91 90 top
Q3  28.81,25.11 0 top
Q4  28.81,13.91 0 top
Q5  57.7,26.95 0 top
R1  27.11,4.91 90 top
R2  29.11,4.91 90 top
R3  30.71,29.89 90 top
R4  29.43,17.75 180 top
R5  54.51,23.21 180 top
R6  27.11,8.91 270 top
R7  29.11,8.91 90 top
R8  39.36,4.86 90 top
R9  61.21,47.71 180 top
R10  62.91,42.81 90 top
R11  43.61,39.51 90 top
R12  41.01,39.51 90 top
R13  58.41,19.21 270 top
R14  43.21,18.91 135 top
R15  56.11,31.31 90 top
R16  46.16,39.51 270 top
R17  51.36,39.61 90 top
REG1  43.51,8.01 0 top
RL1  34.91,10.21 90 top
SG2  54.91,7.91 180 top
TO_FUSE  3.61,35.51 270 top
U2  43.09,25.69 45 top
U$5  [NEXUS2]  62.41,27.01 0 bottom
X1  65.11,16.61 90 top
X3  65.11,32.81 90 top

### Tracks (layer width: path | path; a pad name or v marks a point on that pad's centre or on a via)
+5V-D  (via drill 0.3, 0.4)
  Top 0.25: R12.P$2 41.06,40.11 41.06,44.95 | R11.P$2 43.61,44.95 | R13.P$2 57.91,18.71 | 51.51,19.71 C4.1 | U2.4 | U2.18 45.73,26.53 46.91,27.71 46.91,30.51 47.21,30.81 48.71,30.81 49.11,30.4 J10.2 | v52.91,30.01 53.11,30.21 55.51,30.21 R15.P$1 | D2.C 26.94,17.87 v27.11,17.71 | 51.41,16.51 51.31,16.51 C5.1
  Top 0.3: 40.51,23.41 40.51,23.46 U2.4
  Top 0.406: 57.91,18.71 56.91,19.71 C9.P$2 C35.P$2 51.51,19.71 | v52.91,30.01 52.31,29.41 49.52,29.41 J10.2 | D6.C 32.16,44.9 32.11,44.95
  Top 0.6: D8.C 51.81,16.21 51.71,16.31 51.51,16.31 C5.1 C4.1 | 39.61,13.41 38.31,13.41 | 38.31,13.41 36.91,14.81 | 38.31,13.41 38.31,12.51 36.71,10.91 33.91,10.91 v32.71,9.71 32.27,10.14 D4.C
  Top 0.61: J3.10 43.61,44.95 J3.8 41.06,44.95 J3.6 J3.4 J3.2 32.11,44.95 27.61,44.95 K2.2 | K1.2 18.37,17.87 D2.C | v51.31,18.01 51.41,19.01 | 51.41,16.51 48.31,13.41 39.61,13.41 | 40.51,23.41 36.91,19.81 36.91,14.81
  Top 0.813: D1.C D6.C | J3.2 34.65,44.95 34.61,44.91 34.71,44.91 34.81,45.01
  Top 1: 51.41,19.01 C4.1
  Bottom 0.406: v51.31,18.01 53.31,20.01 53.41,28.61 52.91,29.11 v52.91,30.01
  Bottom 0.6: v27.11,17.71 28.41,16.41 32.11,16.41 33.21,15.31 33.21,10.21 v32.71,9.71
  Bottom 0.61: K2.2 23.98,46.28 21.51,43.81 21.51,32.81 19.61,30.91 19.61,25.21 17.91,23.51 12.73,23.51
  Bottom 1: 12.73,23.51 K1.2
+12V  (via drill 0.6)
  Top 0.813: v58.01,39.31 D7.C 58.61,39.27 D9.C
  Bottom 0.813: J3.19 57.57,39.75 v58.01,39.31
  Bottom 1: J3.19 60.15,42.41 JP1.2
A0  (via drill 0.3)
  Top 0.25: U2.23 44.31,28.68 44.31,30.01 v44.11,30.21
  Bottom 0.25: J3.1 34.71,33.21 39.71,28.21 43.84,28.21 U2.23 43.93,28.33 44.31,28.71 44.31,30.01 v44.11,30.21
A1  (via drill 0.3)
  Top 0.25: v43.11,29.21 43.57,28.74 U2.24
  Bottom 0.25: J3.3 38.41,41.25 38.41,31.11 40.31,29.21 v43.11,29.21
A2  (via drill 0.3)
  Top 0.25: J3.5 39.61,42.23 v39.61,36.71 | U2.25 42.01,29.24 42.01,29.71 42.51,30.21 v42.51,30.31
  Bottom 0.25: v39.61,36.71 39.61,32.11 41.41,30.31 v42.51,30.31
A3
  Top 0.25: U2.26 41.11,29.44 41.11,30.61 41.81,31.31 45.01,31.31 46.91,33.21 48.71,33.21 56.01,40.51 61.31,40.51 61.91,41.11 61.91,42.91 62.21,43.21 62.81,43.21 R10.P$2 62.91,46.51 R9.P$1
A4  (via drill 0.3)
  Top 0.25: v41.01,38.11 R12.P$1 41.91,39.01 42.31,39.41 42.31,42.39 J3.7 | U2.27 41.88,27.94 40.31,29.51 40.31,31.51 40.81,32.01 41.71,32.01 v41.81,32.11
  Bottom 0.25: v41.01,38.11 41.01,32.91 v41.81,32.11
A5  (via drill 0.3)
  Top 0.25: U2.28 39.71,29.41 39.71,31.91 40.71,32.91 43.41,32.91 v44.01,32.31 | v43.61,38.21 R11.P$1 44.31,39.01 44.87,39.57 J3.9
  Bottom 0.25: v43.61,38.21 43.61,32.71 v44.01,32.31
A6  (via drill 0.3)
  Top 0.25: U2.19 45.38,26.88 46.21,27.71 v46.26,27.91 | v29.11,6.31 R2.P$2 28.51,5.41 28.11,5.01 28.11,4.71 27.81,4.41 R1.P$1
  Bottom 0.25: v46.26,27.91 46.21,27.81 37.21,18.81 37.21,15.11 38.61,13.71 45.41,13.71 48.41,10.71 48.41,6.11 47.51,5.21 33.11,5.21 31.81,3.91 30.71,3.91 29.21,5.41 R2.P$2 v29.11,6.31
A7  (via drill 0.3)
  Top 0.25: R7.P$2 R6.P$1 26.91,9.61 25.51,9.61 24.71,10.41 24.71,16.21 v24.41,16.51 | U2.22 45.01,28.67 v45.01,29.61 | v34.21,22.61 31.71,22.61 v31.61,22.71
  Bottom 0.25: v45.01,29.61 45.01,27.91 44.91,27.91 43.71,26.71 35.31,26.71 34.01,25.41 34.01,22.91 34.21,22.71 v34.21,22.61 | v31.61,22.71 27.01,22.71 24.41,20.11 v24.41,16.51
AREF
  Top 0.25: U2.20 45.61,27.85 45.61,28.11 46.01,28.51 46.01,31.16 46.91,32.06 C40.P$1
BAT_CHR
  Top 0.25: J2.10 60.51,47.51 R9.P$2
D2  (via drill 0.3)
  Top 0.25: R4.P$1 30.03,17.59 v30.01,18.11 | v36.91,27.71 38.59,27.71 U2.32
  Bottom 0.25: v36.91,27.71 34.11,27.71 33.01,26.61 33.01,21.91 31.71,20.61 30.81,20.61 30.01,19.81 v30.01,18.11
D3  (via drill 0.3)
  Top 0.25: REG1.4 43.31,11.31 44.31,11.31 | REG1.2 43.51,5.91 | U2.1 38.1,25.2 v38.01,25.11 | v39.81,11.11 43.01,11.11 43.51,10.61 | 43.51,4.34 43.44,4.34 42.41,3.31 39.77,3.31 39.37,2.9
  Top 0.4: R8.P$1 39.36,3.63 39.37,2.9 7805.3
  Top 0.406: REG1.2 43.51,4.34
  Top 0.6: 43.51,5.91 43.51,7.91 | 43.51,7.91 43.51,10.61 REG1.4 | 43.51,7.91 43.41,8.01 39.21,8.01 37.11,5.91 33.61,5.91 32.71,6.81 31.22,6.81 D4.A
  Bottom 0.25: v38.01,25.11 38.01,24.61 36.41,23.01 36.41,14.61 39.81,11.21 v39.81,11.11
D4
  Top 0.25: R3.P$2 30.79,30.31 31.71,30.31 33.51,28.51 33.51,24.81 34.81,23.51 39.14,23.51 U2.2
D6  (via drill 0.3)
  Top 0.25: U2.10 45.31,21.7 v45.31,21.51 | v47.31,9.81 48.81,9.81 v53.31,14.31
  Bottom 0.25: J3.11 47.41,33.91 48.11,33.21 49.21,33.21 50.01,32.41 50.01,28.81 49.31,28.11 49.31,26.11 46.91,23.71 46.91,22.91 45.51,21.51 45.11,21.61 v45.31,21.51 52.51,14.31 v53.31,14.31 | RL1.P2 37.97,7.67 38.61,8.31 45.81,8.31 v47.31,9.81
D7  (via drill 0.3)
  Top 0.25: v45.21,22.81 44.91,22.81 U2.11 | 49.31,39.01 R16.P$2 46.16,38.31 | 49.31,39.01 51.26,39.01 R17.P$1 | J3.12 48.66,43.71 48.66,41.16 49.11,40.71 49.11,39.21 49.31,39.01
  Top 0.3: v46.11,38.11 46.16,38.31
  Bottom 0.25: v46.11,38.11 46.11,33.61 47.51,32.21 48.71,32.21 49.21,31.71 49.21,29.21 48.51,28.51 48.51,26.51 48.41,26.51 45.41,23.51 45.41,23.01 v45.21,22.81
D9
  Top 0.25: U2.13 47.52,21.61 52.31,21.61 53.91,23.21 R5.P$2
D10  (via drill 0.3)
  Top 0.25: U2.14 45.34,24.48 47.21,22.61 51.21,22.61 v51.71,23.11 | v53.31,32.61 v53.31,35.81
  Bottom 0.25: v53.31,32.61 51.71,31.01 51.71,28.21 52.61,27.31 52.61,24.01 v51.71,23.11 | v53.31,35.81 53.31,40.81 53.71,41.21 53.71,46.19
D11  (via drill 0.3)
  Top 0.25: U2.15 45.69,24.82 46.61,23.91 46.91,23.91 | 55.11,31.81 56.21,32.91 56.21,35.36 v56.31,35.46 | v51.41,32.71 52.61,31.51 54.81,31.51 55.11,31.81 | J10.5 49.15,26.14 46.91,23.91 | 46.91,23.91 48.26,23.91 v48.56,23.61 | R15.P$2 55.11,31.81
  Bottom 0.25: J3.18 55.47,44.95 56.31,44.16 v56.31,35.46 | v51.41,32.71 50.81,32.11 50.81,27.31 50.31,26.81 50.31,24.01 49.91,23.61 v48.56,23.61
D12
  Top 0.25: U2.16 47.1,25.2 48.31,26.41 48.31,27.03 J10.3
D13  (via drill 0.3)
  Top 0.25: J10.1 47.98,27.88 47.31,27.21 47.31,27.01 v47.01,26.71 46.47,26.17 U2.17
  Bottom 0.25: v47.01,26.71 46.51,26.41 43.31,23.21 43.31,22.01 52.61,12.71 52.61,9.71 51.1,8.2 SG2.+
FAN  (via drill 0.4)
  Top 0.4: Q5.3 60.34,28.84 61.48,30.21 v61.81,30.61
  Top 0.406: v61.81,30.61 61.81,30.54 61.48,30.21
  Bottom 0.25: J3.20 57.57,44.65
  Bottom 0.4: J3.20 60.15,44.95 JP1.1 61.41,45.01 62.21,44.21 62.21,40.01 61.81,39.61
  Bottom 0.406: 61.81,39.61 v61.81,30.61
GND  (via drill 0.3)
  other vias: 1.01,48.71 0.81,45.81 0.91,42.81 1.01,39.81 0.91,37.11 0.91,34.41 1.01,31.91 0.91,29.31 0.91,25.91 0.91,22.71 0.91,18.51 1.01,14.41 1.01,11.01 0.81,7.71 0.91,4.81 0.81,1.21 4.11,0.81 8.21,0.81 11.91,0.71 16.71,0.71 19.61,0.71 33.61,0.91 36.81,0.81 37.61,2.71 47.71,0.71 43.11,0.76 48.51,12.31 53.01,1.01 56.61,1.01 61.31,1.01 64.91,1.01 69.01,1.11 69.21,4.71 69.31,7.71 68.91,10.21 69.01,14.41 69.31,19.31 69.21,23.41 69.31,27.71 69.21,31.01 69.31,35.81 69.31,40.71 69.21,43.91 69.21,47.81 67.01,49.21 63.81,49.31 60.31,49.21 56.81,49.21 53.61,49.21 51.21,49.11 30.81,49.21 27.61,49.21 23.71,49.11 18.91,49.21 12.31,49.31 6.21,49.01 3.41,49.11 36.01,48.41 41.06,48.41 43.61,48.41 46.16,48.41 5.91,42.61 5.01,35.81 10.31,35.41 17.11,43.11 19.51,37.91 23.91,43.01 25.41,44.41 28.21,43.41 26.51,41.91 23.11,37.91 25.41,38.51 30.21,38.41 30.41,42.61 22.01,46.91 11.61,44.91 5.81,30.51 10.11,28.21 14.51,25.41 17.11,29.71 12.41,31.61 21.11,27.31 21.91,30.91 19.01,33.01 23.11,34.11 25.41,32.21 25.91,27.11 28.11,32.61 27.41,36.01 33.41,40.61 33.21,37.51 31.61,34.91 36.21,40.21 36.11,36.91 36.21,34.41 42.11,38.01 42.21,36.01 44.81,38.21 49.76,40.01 48.61,37.01 51.31,40.31 54.41,40.11 61.01,34.41 57.01,39.01 58.81,41.11 58.86,43.91 59.11,46.01 65.31,47.11 64.31,44.81 65.41,43.31 67.51,42.91 69.21,45.71 67.51,47.61 59.91,39.81 63.41,40.81 57.21,36.91 54.11,37.31 51.81,35.21 50.61,33.41 55.51,33.11 57.21,31.21 57.11,34.01 60.31,36.41 60.31,30.81 53.71,30.86 45.01,30.51 45.51,32.91 43.01,32.01 43.31,30.66 47.51,31.46 51.46,31.71 52.51,30.76 52.36,33.46 41.26,25.86 43.06,27.46 43.06,23.81 38.86,24.41 38.96,25.96 34.36,26.76 34.81,24.81 36.76,24.76 36.96,28.76 34.36,28.76 31.86,28.96 31.96,31.26 35.16,31.26 32.26,27.46 29.96,26.36 27.56,26.36 27.76,28.56 27.86,30.86 25.26,30.26 23.26,29.66 23.46,27.46 21.06,24.26 16.26,22.06 19.26,19.36 23.46,19.16 23.66,21.06 27.56,20.86 26.06,23.16 32.26,18.76 29.36,20.76 61.36,43.71 62.06,46.01 33.96,21.06 38.66,22.76 39.26,19.66 37.96,18.46 37.96,17.16 38.26,15.86 38.96,15.16 39.86,14.46 41.66,14.36 42.76,15.26 44.36,15.26 45.46,15.66 46.46,17.16 46.06,18.16 45.16,19.16 43.16,20.56 42.51,21.41 40.66,21.36 41.51,18.96 42.41,18.06 47.76,15.06 49.66,20.76 46.56,21.36 51.76,20.96 51.16,24.26 52.51,22.81 55.41,22.06 54.41,25.56 58.31,30.16 60.51,24.76 63.31,24.86 59.41,23.26 59.91,18.96 53.51,17.06 53.01,18.36 47.66,20.76 52.76,15.16 50.56,13.36 51.16,9.96 54.36,11.56 54.66,9.06 55.06,14.76 57.46,11.26 57.36,5.06 61.06,2.86 55.36,2.96 51.96,2.86 48.36,3.36 49.56,5.46 26.11,2.86 21.71,2.76 19.81,6.86 20.71,4.96 24.91,6.96 27.11,7.26 20.11,14.96 28.11,10.26 37.31,9.86 44.61,9.36 42.21,9.16 44.41,6.86 41.11,6.96 45.61,6.86 47.41,8.06 46.61,10.96 40.51,10.16 35.71,16.16 33.11,16.76 30.11,15.36 26.91,16.36 25.91,12.06 28.11,11.96 30.31,12.06 23.61,16.46 19.71,16.46 20.11,11.86 20.51,9.86 16.91,9.86 17.01,17.06 12.71,14.96 14.41,11.96 11.11,10.86 5.41,10.66 16.81,6.76 17.81,2.46 13.71,4.96 7.41,5.16 6.11,15.16 9.21,15.56 14.41,19.26 11.61,22.36 7.41,23.46 5.71,28.06 12.11,38.26 52.51,28.41 51.31,26.96 58.76,28.66 61.86,29.16 66.91,2.51 64.31,4.01 64.71,6.01 66.61,7.21 68.51,6.61 4.71,46.91 5.51,44.81 2.31,47.31 3.11,42.81 59.61,33.01 55.11,30.86 48.31,40.06 37.31,21.96 40.61,12.26
  pour Top (no thermals): -2.39,52.51 73.91,52.51 73.91,-1.99 -2.39,-1.99
  pour Bottom: -0.89,50.91 71.51,50.91 71.51,-1.39 -0.89,-1.39
N$1
  Top 1.8: TO_FUSE.2 8.25,32.97 13.81,27.41 16.69,27.41 K1.1
N$2
  Top 0.6: D8.A 60.11,16.21 61.51,17.61 61.51,20.31 62.71,21.51 65,21.51 X1.3
N$3  (via drill 0.3)
  Top 0.254: D6.A 32.16,48.06 v32.81,48.71
  Bottom 0.254: J2.8 52.49,47.39 52.03,47.39 51.01,48.41 50.61,48.81 50.31,49.11 33.21,49.11 v32.81,48.71
N$5
  Top 0.4: D2.A 27.07,21.81 Q1.3 29.51,21.91 30.61,21.91 31.41,21.11 31.41,13.97 Q4.3
  Top 1: D2.A 25.37,21.14 22.91,23.61 22.91,25.33 K1.5
N$6
  Top 0.4: Q2.3 26.71,33.85 K2.5
  Top 0.61: D1.A 32.16,37.86 28.41,34.11 26.45,34.11
  Top 1: 26.45,34.11 K2.5
  Bottom 0.4: Q3.3 31.35,26.47 30.61,27.21 27.61,27.21 26.41,28.41 26.41,34.15 K2.5
N$7
  Bottom 1.8: JP14.3 9.41,3.01 D3.A
N$8
  Top 0.813: X3.3 63.34,37.81 D7.A
N$21
  Top 0.25: R5.P$1 55.11,23.31 55.11,23.51 57.61,26.01 57.61,26.86 Q5.2
N$23
  Top 0.4: Q1.1 28.46,18.22 R4.P$2 28.93,14.03 Q4.2
N$26
  Bottom 1.8: K1.4 22.76,5.05 D3.C
N$67
  Top 0.25: U2.8 44.01,21.32 44.01,19.11 43.56,18.66 R14.P$1 | C41.P$1 43.56,18.46 R14.P$1 | CK1.P1 43.56,17.81 R14.P$1
N$68  (via drill 0.3)
  Top 0.25: U2.7 41.36,22.19 C42.P$1 v42.11,19.91 42.76,19.26 R14.P$2 | CK1.P3 38.71,17.12 v38.71,17.91
  Bottom 0.25: v38.71,17.91 40.71,19.91 v42.11,19.91
OUT
  Top 0.25: R1.P$2 26.51,6.01 10.61,6.01 6.91,9.71 6.91,19.71 JP9.2
  Bottom 1.8: K2.3 14.08,42.88 7.71,36.51 7.71,27.11 JP9.2
PS_IN
  Top 0.25: R6.P$2 15.63,8.41 K1.3
  Bottom 1.8: JP14.1 10.49,13.01 K1.3
RELE_BAT  (via drill 0.4)
  Top 0.25: 46.16,4.97 45.82,5.31 REG1.3
  Top 0.4: D5.C 44.66,1.81 7805.1 45.82,3.37 REG1.3 | D9.A 59.54,34.47 63.11,30.91 63.11,29.31 62.11,28.31 62.11,22.61 v60.01,20.51
  Bottom 0.25: RL1.P1 35.69,2.59 36.51,3.41 43.06,3.41 7805.1
  Bottom 0.4: v60.01,20.51 59.11,20.51 55.81,17.21 55.81,5.31 52.31,1.81 44.66,1.81 7805.1
RESET  (via drill 0.3)
  Top 0.25: U2.29 39.01,29.41 39.01,32.21 40.41,33.61 45.81,33.61 46.51,34.31 v48.61,34.31 | v58.11,24.11 58.11,23.31 C3.P$2 58.41,22.71 R13.P$1 | J10.4 51.35,27.87 52.31,26.91 | 52.31,26.91 52.71,26.51 52.71,24.71 52.91,24.51 v54.41,24.51 | 52.31,26.91 v54.61,29.21
  Bottom 0.25: v48.61,34.31 53.71,34.31 54.31,33.71 54.31,29.51 v54.61,29.21 | 57.91,24.31 v58.11,24.11 57.71,24.51 v54.41,24.51
RESETT  (via drill 0.3)
  Top 0.25: v56.81,22.31 56.81,23.01 C3.P$1
  Bottom 0.25: J3.17 55.03,34.69 62.21,27.51 62.21,24.01 60.41,22.21 56.91,22.21 v56.81,22.31
RX-I
  Top 0.25: U2.30 38.41,29.31 38.41,32.71 39.91,34.21 45.31,34.21 46.21,35.11 49.91,35.11 53.71,38.91 53.71,43.73 J3.16
STARTUP
  Top 0.4: R3.P$1 29.24,29.39 Q2.1 Q3.2
SW_A  (via drill 0.4)
  Top 0.406: v35.31,29.51 35.31,25.61 v35.71,25.21
  Top 1.8: TO_FUSE.1 5.17,37.97 7.41,40.21 28.2,40.21 K2.1
  Bottom 0.25: 49.95,42.57 48.81,43.71 30.08,43.71 28.28,41.91 K2.1
  Bottom 0.4: 49.95,42.57 J3.13
  Bottom 0.406: v35.31,29.51 28.2,36.61 28.2,40.21 K2.1 | v35.71,25.21 35.71,24.61 35.31,24.21 35.31,18.23 RL1.P4
SW_B  (via drill 0.3)
  Top 0.25: J2.7 49.95,47.45 48.71,46.21 46.01,46.21 | 46.01,46.21 30.31,46.21 v30.01,46.51 | R16.P$1 46.16,46.06 46.01,46.21 | v49.91,3.11 49.91,1.97 D5.A
  Bottom 0.25: v30.01,46.51 29.81,46.51 24.31,41.01 24.31,28.01 24.71,27.61 24.71,23.81 22.61,21.71 22.61,16.31 24.71,14.21 24.71,8.11 29.81,3.01 32.51,3.01 33.81,4.31 48.71,4.31 v49.91,3.11
TX-O
  Top 0.25: U2.31 37.71,29.31 37.71,33.21 39.31,34.81 44.61,34.81 45.71,35.91 49.81,35.91 52.51,38.61 52.51,42.39 J3.15

### Text on the board
tNames: LED GND.D7.D6 / / SCL GND.5V.A5 / / SDA GND.5V.A4 / / TEMP3 GND.5V.A2 / / TEMP2 GND.5V.A1 / / TEMP1 GND.5V.A0 | FANRET.12V / / BCHR.FANRET.12V / / UART GND.D11.RST / / UART 5V.RX.TX / / SWITCH A<>B | +12 / / GND / / -12
bNames: +12 / GND / -12 / +5 / GND / +3.3 | NEXUS / POWER GUARD / V1.01 | FUSE1 / FUSE2 / GND / OUT / GND / FONT / GND / BAT
Reference: FUSE -> / / -> | OUT + -> | +5 / / GND | PS + -> | +12 / GND / -12 / +5 / GND / +3.3 | +3.3 | BAT + ->